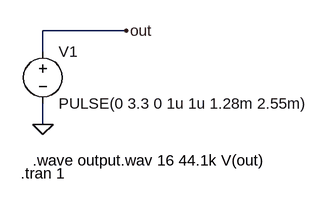
[diagram p0: schematic SoundSim.asc]
SoundSim.asc, the LTspice schematic file:
Version 4
SHEET 1 880 680
WIRE 240 96 112 96
WIRE 112 128 112 96
WIRE 112 240 112 208
FLAG 112 240 0
FLAG 240 96 out
SYMBOL voltage 112 112 R0
WINDOW 123 0 0 Left 0
WINDOW 39 0 0 Left 0
SYMATTR InstName V1
SYMATTR Value PULSE(0 3.3 0 1u 1u 1.28m 2.55m)
TEXT 96 296 Left 2 !.wave output.wav 16 44.1k V(out)
TEXT 78 316 Left 2 !.tran 1

The netlist it stands for:
* SoundSim.asc
V1 out 0 PULSE(0 3.3 0 1u 1u 1.28m 2.55m)
.wave output.wav 16 44.1k V(out)
.tran 1
.backanno
.end